# Altium project 243-5xx_Pi-CAN-PWM.PrjPcb
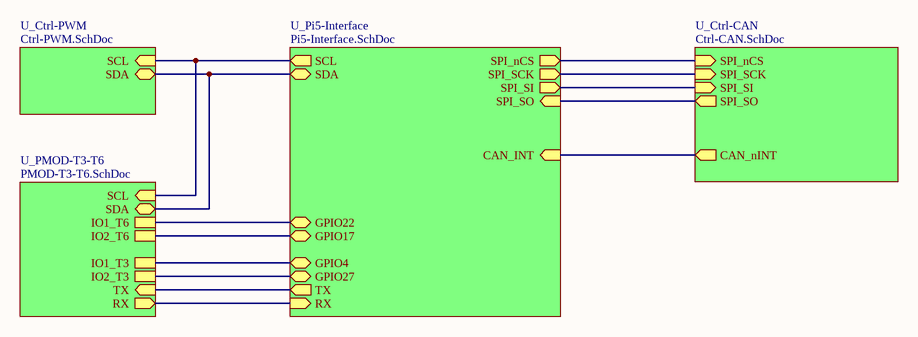
[diagram p0: 243-5xx_Pi-CAN-PWM.SchDoc]
Revision: Rev.B; NomDeProjet: 243-5xx Pi-CAN_PWM; NomDeLetudiant: Cégep Limoilou
5 sheets, 39 parts. Net scope: hierarchical (ports join the sheet entries above them; power ports are global).
Board file: 243-5xx_Pi-CAN-PWM.PcbDoc
Sheets:
  243-5xx_Pi-CAN-PWM.SchDoc
    U_Ctrl-CAN = Ctrl-CAN.SchDoc
    U_Ctrl-PWM = Ctrl-PWM.SchDoc
    U_Pi5-Interface = Pi5-Interface.SchDoc
    U_PMOD-T3-T6 = PMOD-T3-T6.SchDoc

## Sheet 243-5xx_Pi-CAN-PWM.SchDoc: CAN Controller + Transceiver and Ctrl PWM
size Letter; ApprovedBy: k.cotton; Author: Cégep Limoilou; Engineer: K.Cotton; Organization: Cegep Limoilou; Address1: 1300, 8e Avenue; Address2: Québec, QC; Address3: Canada; Address4: G1J 5L5; SheetNumber: 1; SheetTotal: 4

### Sub-sheets
U_Ctrl-CAN = Ctrl-CAN.SchDoc: SPI_nCS (in), SPI_SCK (in), SPI_SI (in), SPI_SO (out), CAN_nINT (out)
U_Ctrl-PWM = Ctrl-PWM.SchDoc: SCL (in), SDA (bidir)
U_Pi5-Interface = Pi5-Interface.SchDoc: SPI_SI (out), SPI_nCS (out), SPI_SCK (out), SPI_SO (in), SCL (out), SDA (bidir), RX (in), TX (out), CAN_INT (in), GPIO4 (bidir), GPIO27 (bidir), GPIO22 (bidir), GPIO17 (bidir)
U_PMOD-T3-T6 = PMOD-T3-T6.SchDoc: RX (out), TX (in), SCL (in), SDA (bidir), IO1_T3, IO2_T3, IO1_T6, IO2_T6

### Nets
CAN_INT: sheet U_Ctrl-CAN/CAN_nINT, sheet U_Pi5-Interface/CAN_INT
GPIO4: sheet U_Pi5-Interface/GPIO4, sheet U_PMOD-T3-T6/IO1_T3
GPIO17: sheet U_Pi5-Interface/GPIO17, sheet U_PMOD-T3-T6/IO2_T6
GPIO22: sheet U_Pi5-Interface/GPIO22, sheet U_PMOD-T3-T6/IO1_T6
GPIO27: sheet U_Pi5-Interface/GPIO27, sheet U_PMOD-T3-T6/IO2_T3
RX: sheet U_Pi5-Interface/RX, sheet U_PMOD-T3-T6/RX
SCL: sheet U_Ctrl-PWM/SCL, sheet U_Pi5-Interface/SCL, sheet U_PMOD-T3-T6/SCL
SDA: sheet U_Ctrl-PWM/SDA, sheet U_Pi5-Interface/SDA, sheet U_PMOD-T3-T6/SDA
SPI_nCS: sheet U_Ctrl-CAN/SPI_nCS, sheet U_Pi5-Interface/SPI_nCS
SPI_SCK: sheet U_Ctrl-CAN/SPI_SCK, sheet U_Pi5-Interface/SPI_SCK
SPI_SI: sheet U_Ctrl-CAN/SPI_SI, sheet U_Pi5-Interface/SPI_SI
SPI_SO: sheet U_Ctrl-CAN/SPI_SO, sheet U_Pi5-Interface/SPI_SO
TX: sheet U_Pi5-Interface/TX, sheet U_PMOD-T3-T6/TX

### Notes on the sheet
- Titre :
- Conception :
- Date :
- Approbation :
- Heure :
- Révision :
- Feuille
- de
- Fichier :

## Sheet Ctrl-CAN.SchDoc: SPI to CAN Controller/Transeiver
size Letter; ApprovedBy: k.cotton; Author: Cégep Limoilou; Engineer: K.Cotton; Organization: Cegep Limoilou; Address1: 1300, 8e Avenue; Address2: Québec, QC; Address3: Canada; Address4: G1J 5L5; SheetNumber: 3; SheetTotal: 5
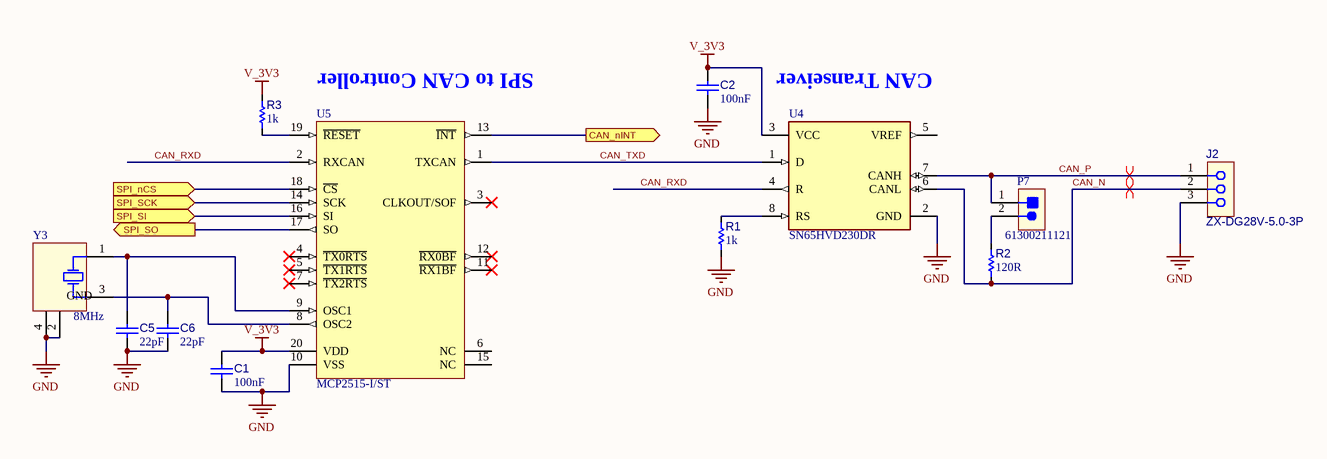
[diagram p1: Ctrl-CAN.SchDoc]

### Parts
C1  value 100nF  [C_1005[0402]]  (hidden comment: CAP CER 100nF 50V 0402)
C2  value 100nF  [C_1005[0402]]  (hidden comment: CAP CER 100nF 50V 0402)
C5  value 22pF  [C_1005[0402]]  (hidden comment: CAP CER 22pF 50V COG 0402)
C6  value 22pF  [C_1005[0402]]  (hidden comment: CAP CER 22pF 50V COG 0402)
J2  ZX-DG28V-5.0-3P  [CONN_TERM_BLOCK_3POS_5mm_Model1]
P7  61300211121  [CONN_HDR_2POS_100MILS_TH]
R1  value 1k  [R_1005[0402]]  (hidden comment: Res 1k 1% 0402)
R2  value 120R  [R_3216[1206]]  (hidden comment: Res 120R 1% 1206)
R3  value 1k  [R_1005[0402]]  (hidden comment: Res 1k 1% 0402)
U4  SN65HVD230DR  [FP-D0008A-IPC_A]
U5  MCP2515-I/ST  [TSSOP-ST20_N]
Y3  value 8MHz  [Y_32x25SMD4]  (hidden comment: XC32M4-8.000-F18LJDT)

### Ports
CAN_nINT (out, see 243-5xx_Pi-CAN-PWM[3B]), SPI_nCS (in, see 243-5xx_Pi-CAN-PWM[3B], Pi5-Interface[3C]), SPI_SCK (in, see 243-5xx_Pi-CAN-PWM[3B], Pi5-Interface[1C]), SPI_SI (in, see 243-5xx_Pi-CAN-PWM[3B], Pi5-Interface[1C]), SPI_SO (out, see 243-5xx_Pi-CAN-PWM[3B], Pi5-Interface[1C])

### Nets
GND: C1.1 C2.1 C5.1 C6.1 J2.3 R1.1 U4.2(GND) U5.10(VSS) Y3.2(GND) Y3.4(GND)
V_3V3: C1.2 C2.2 R3.2 U4.3(VCC) U5.20(VDD)
CAN_INT: U5.13(~{INT}) ; port CAN_nINT
CAN_N: J2.2 R2.1 U4.6(CANL)
CAN_P: J2.1 P7.1 U4.7(CANH)
CAN_RXD: U4.4(R) U5.2(RXCAN)
CAN_TXD: U4.1(D) U5.1(TXCAN)
SPI_nCS: U5.18(~{CS}) ; port SPI_nCS
SPI_SCK: U5.14(SCK) ; port SPI_SCK
SPI_SI: U5.16(SI) ; port SPI_SI
SPI_SO: U5.17(SO) ; port SPI_SO
NetC5_2: C5.2 U5.9(OSC1) Y3.1(XTAL)
NetC6_2: C6.2 U5.8(OSC2) Y3.3(XTAL)
NetP7_2: P7.2 R2.2
NetR1_2: R1.2 U4.8(RS)
NetR3_1: R3.1 U5.19(~{RESET})

Not connected (* = marked no-connect by the designer): U4 5(VREF); U5 3(CLKOUT/SOF)* 4(~{TX0RTS})* 5(~{TX1RTS})* 6(NC) 7(~{TX2RTS})* 11(~{RX1BF})* 12(~{RX0BF})* 15(NC)

### Layout directives
differential pair: CAN_N, CAN_P

### Notes on the sheet
- SPI to CAN Controller
- (near U4) CAN Transeiver
- Titre :
- Conception :
- Date :
- Approbation :
- Heure :
- Révision :
- Feuille
- de
- Fichier :

### Library data of the parts
C1 C2 = CAP001: Capacitor type 1; Manufacturer 1: Yageo; Manufacturer Part Number 1: CC0402KRX7R9BB104; LibRef: CAP001; Code CEGEP: KCOND01SM; Tolerance: 10%; Dielectric: X7R; Rated Voltage: 50V; Mounting Technology: SMT; Supplier 1: LCSC; Supplier Part Number 1: C131394
C5 C6 = CAP010: Capacitor type 1; Manufacturer 1: Yageo; Manufacturer Part Number 1: CC0402JRNPO9BN220; LibRef: CAP010; Tolerance: 5%; Dielectric: C0G; Rated Voltage: 50V; Mounting Technology: SMT; Supplier 1: LCSC; Supplier Part Number 1: C106203
J2 = CONN-5MM-3POS-TERM-BLOCK: CONN TERM BLOCK 3POS 5mm pitch; Manufacturer 1: Megastar; Code CEGEP: CONWECO0003 / KCONWECO0030; Localisation: / R13-E102; Supplier 1: LCSC; Supplier Part Number 1: ZX-DG28V-5.0-3P; Manufacturer Part Number 1: ZX-DG28V-5.0-3P; Mounting Technology: TH; Manufacturer 2: Weco - Phoenix Contact; Manufacturer Part Number 2: 950-DS/03 - 1890976
P7 = CONN-100MIL-HDR-01X02: CONN HEADER 2POS 100MIL; Manufacturer 1: Megastar; Manufacturer Part Number 1: ZX-PZ2.54-1-2PZZ; Mounting Technology: TH; Supplier 1: LCSC; Supplier Part Number 1: C7501260; Manufacturer 2: Würth Elektronik; Manufacturer Part Number 2: 61300211121
R1 R3 = RES006: Resistor type 1; Manufacturer 1: Yageo; Manufacturer Part Number 1: RC0402FR-071kL; LibRef: RES006; Code CEGEP: RES1KSM; Puissance: 1/16W; Max Working Voltage: 50V; Tolerance: 1%; Mounting Technology: SMT; Supplier 1: LCSC; Supplier Part Number 1: C106235
R2 = RES014: Resistor type 1; Manufacturer 1: Yageo; Manufacturer Part Number 1: RC1206FR-07120RL; LibRef: RES014; Code CEGEP: RESI0043SMT; Puissance: 1/4W; Max Working Voltage: 200V; Tolerance: 1%; Mounting Technology: SMT; Supplier 1: LCSC; Supplier Part Number 1: C114928; Supplier 2: Digikey; Supplier Part Number 2: P120ECT-ND
U4 = CMP-0315-00015-3: IC TRANSCEIVER HALF 1/1 8SOIC; Number of Transceivers: 1; Operating Supply Voltage: 3.3V; Number of I/Os: 2; Max Supply Current: 17mA; Max Supply Voltage: 3.6V; Min Supply Voltage: 3V; Data Rate: 1Mbps; Min Operating Temperature: -40°C; Packaging: Tape and Reel; Lead Free: Lead Free; Number of Transmit Buffers: 1; Max Operating Temperature: 85°C; Number of Receive Buffers: 1; Number of Pins: 8; Package Quantity: 1; Radiation Hardening: No; Case/Package: D; REACH SVHC: No SVHC; Weight: 0.002561oz; Termination: SMD/SMT; Contact Plating: Gold; Nominal Supply Current: 17mA; Number of Receivers: 1; Number of Drivers: 1
U5 = CMP-0186-00077-2: Stand-Alone CAN Controller With SPI Interface, 20-Pin TSSOP, Industrial Temperature; DatasheetVersion: revF, Oct-2010; ComponentLink1Description: Manufacturer URL; PackageDescription: 20-Lead Plastic Thin Shrink Small Outline (ST) - 4.4mm Body [TSSOP]; ComponentLink1URL: http://www.microchip.com/; RevisionNote: URLs added. DatasheetVersion updated.; PackageReference: TSSOP-ST20; Code_JEDEC: MO-153-AC; ComponentLink2Description: Datasheet; ComponentLink2URL: http://ww1.microchip.com/downloads/en/DeviceDoc/21801f.pdf; PackageVersion: revBB, Aug-2009; ComponentLink3URL: http://www.microchip.com/stellent/groups/techpub_sg/documents/packagingspec/en012702.pdf; ComponentLink3Description: Package Specification
Y3 = Y_XTAL25MHz: Crystal, 8MHz, 3.2 x 2.5 x 0.9 mm SMD; Manufacturer 1: HCI; Technology: SMT; Part Number 1: XC32M4-8.000-F18LJDT; Supplier 1: LCSC; Supplier Part Number 1: C2905353

## Sheet Ctrl-PWM.SchDoc: I2C to PWM Controller
size Letter; ApprovedBy: k.cotton; Author: Cégep Limoilou; Engineer: K.Cotton; Organization: Cegep Limoilou; Address1: 1300, 8e Avenue; Address2: Québec, QC; Address3: Canada; Address4: G1J 5L5; SheetNumber: 4; SheetTotal: 5
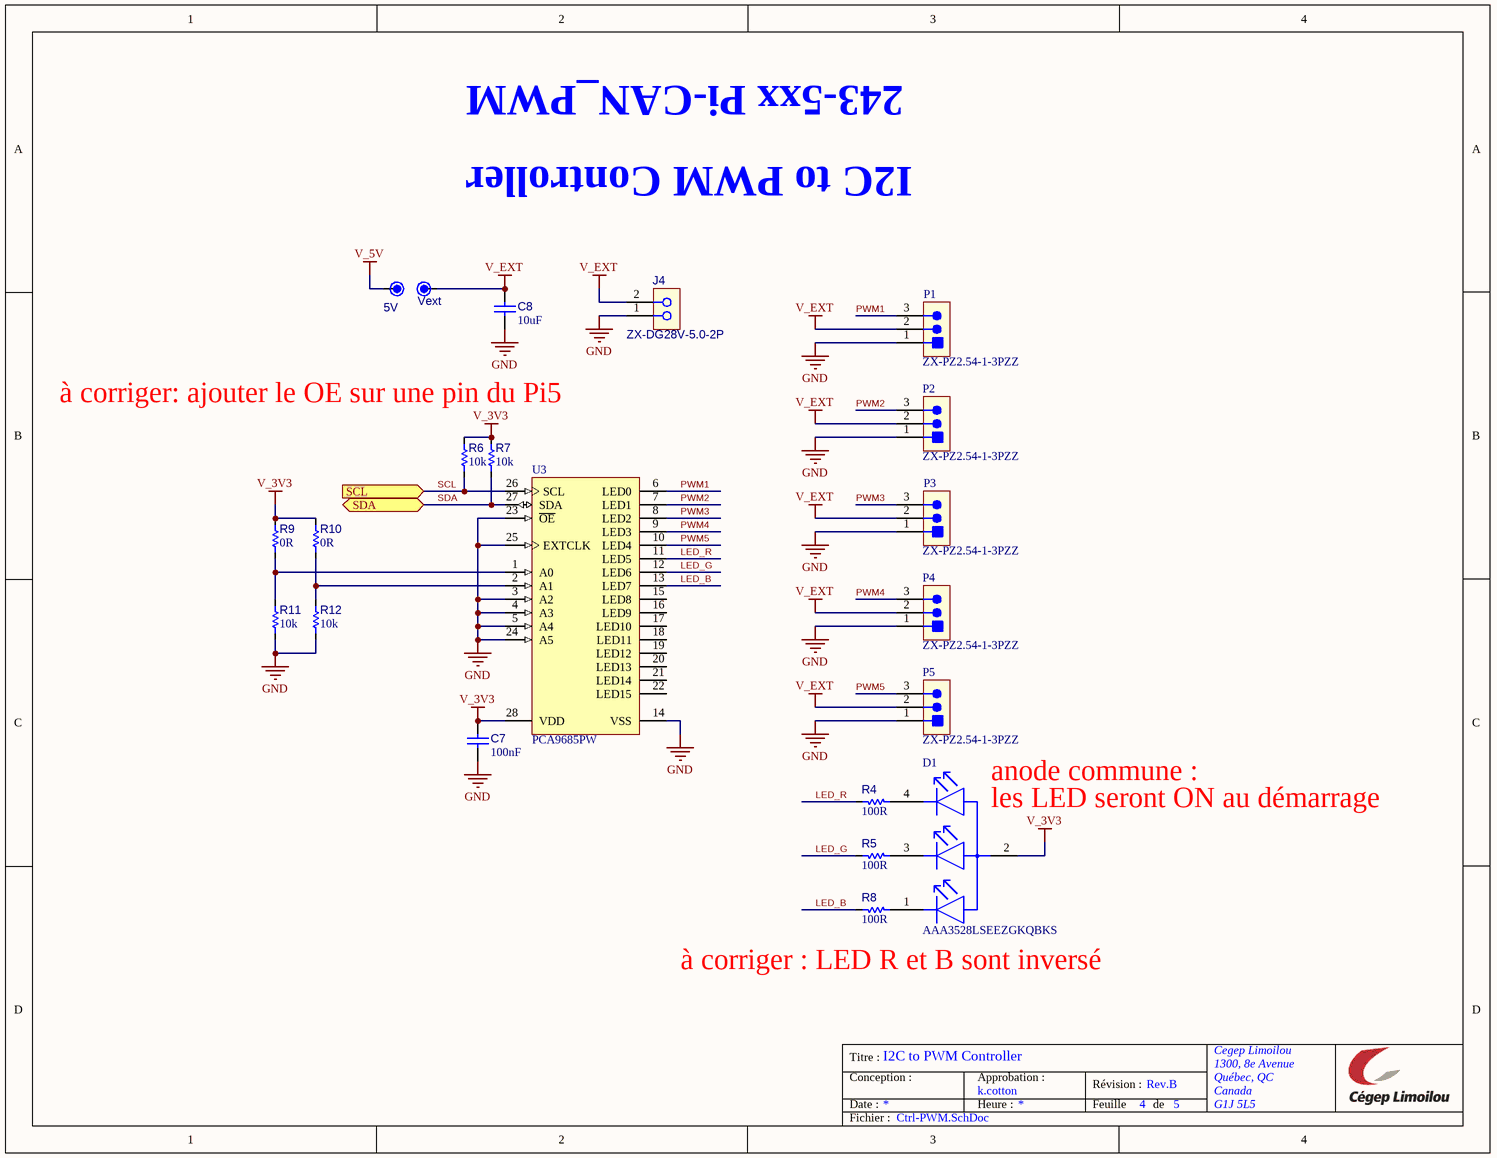
[diagram p2: Ctrl-PWM.SchDoc]

### Parts
5V  DNP  [TP_TH061]  (value not drawn)  (no BOM)
C7  value 100nF  [C_1005[0402]]  (hidden comment: CAP CER 100nF 50V 0402)
C8  value 10uF  [C_2012[0805]]  (hidden comment: CAP CER 10uF 10V X7R 0805)
D1  AAA3528LSEEZGKQBKS  [FP-AAA3528LSEEZGKQBKS-MFG]
J4  ZX-DG28V-5.0-2P  [CONN_TERM_BLOCK_2POS_5mm_Model1]
P1  ZX-PZ2.54-1-3PZZ  [CONN_HDR_3POS_100MILS_TH]
P2  ZX-PZ2.54-1-3PZZ  [CONN_HDR_3POS_100MILS_TH]
P3  ZX-PZ2.54-1-3PZZ  [CONN_HDR_3POS_100MILS_TH]
P4  ZX-PZ2.54-1-3PZZ  [CONN_HDR_3POS_100MILS_TH]
P5  ZX-PZ2.54-1-3PZZ  [CONN_HDR_3POS_100MILS_TH]
R4  value 100R  [R_1608[0603]]  (hidden comment: Res 100R 1% 0603)
R5  value 100R  [R_1608[0603]]  (hidden comment: Res 100R 1% 0603)
R6  value 10k  [R_1005[0402]]  (hidden comment: Res 10k 1% 0402)
R7  value 10k  [R_1005[0402]]  (hidden comment: Res 10k 1% 0402)
R8  value 100R  [R_1608[0603]]  (hidden comment: Res 100R 1% 0603)
R9  value 0R  [R_1005[0402]]  (hidden comment: DNP)  (no BOM)
R10  value 0R  [R_1005[0402]]  (hidden comment: DNP)  (no BOM)
R11  value 10k  [R_1005[0402]]  (hidden comment: Res 10k 1% 0402)
R12  value 10k  [R_1005[0402]]  (hidden comment: Res 10k 1% 0402)
U3  PCA9685PW  [TSSOP28_SOT361-1_V]
Vext  DNP  [TP_TH061]  (value not drawn)  (no BOM)

### Ports
SCL (in, see 243-5xx_Pi-CAN-PWM[2B], Pi5-Interface[2B], PMOD-T3-T6[2C]), SDA (bidir, see 243-5xx_Pi-CAN-PWM[2B], Pi5-Interface[2B], PMOD-T3-T6[2C])

### Nets
GND: C7.1 C8.1 J4.1 P1.1 P2.1 P3.1 P4.1 P5.1 R11.1 R12.1 U3.3(A2) U3.4(A3) U3.5(A4) U3.14(VSS) U3.23(~{OE}) U3.24(A5) U3.25(EXTCLK)
V_3V3: C7.2 D1.2(COMMON_ANODE) R6.2 R7.2 R9.2 R10.2 U3.28(VDD)
V_5V: 5V.1
V_EXT: C8.2 J4.2 P1.2 P2.2 P3.2 P4.2 P5.2 Vext.1
LED_B: R8.2 U3.13(LED7)
LED_G: R5.2 U3.12(LED6)
LED_R: R4.2 U3.11(LED5)
PWM1: P1.3 U3.6(LED0)
PWM2: P2.3 U3.7(LED1)
PWM3: P3.3 U3.8(LED2)
PWM4: P4.3 U3.9(LED3)
PWM5: P5.3 U3.10(LED4)
SCL: R6.1 U3.26(SCL) ; port SCL
SDA: R7.1 U3.27(SDA) ; port SDA
NetD1_1: D1.1(RED_C) R8.1
NetD1_3: D1.3(GREEN_C) R5.1
NetD1_4: D1.4(BLUE_C) R4.1
NetR9_1: R9.1 R11.2 U3.1(A0)
NetR10_1: R10.1 R12.2 U3.2(A1)

Not connected (* = marked no-connect by the designer): U3 15(LED8) 16(LED9) 17(LED10) 18(LED11) 19(LED12) 20(LED13) 21(LED14) 22(LED15)

### Notes on the sheet
- à corriger: ajouter le OE sur une pin du Pi5
- (near D1) anode commune :
- (near D1) les LED seront ON au démarrage
- à corriger : LED R et B sont inversé
- Titre :
- Conception :
- Date :
- Approbation :
- Heure :
- Révision :
- Feuille
- de
- Fichier :

### Library data of the parts
5V Vext = TP_TH0.61mm(AWG28): Pad TH 0.61mm diameter (AWG28); Value: DNP; Manufacturer Part Number 1: DNP; Supplier Part Number 1: N/A; Supplier 1: N/A
C7 = CAP001: as C1 on sheet Ctrl-CAN; Rated Voltage: 50V; Mounting Technology: SMT; Supplier 1: LCSC; Supplier Part Number 1: C131394
C8 = CAP004: Capacitor type 1; Manufacturer 1: muRata; Manufacturer Part Number 1: GRM21BR71A106KE51L; LibRef: CAP004; Code CEGEP: KCOND03SM; Tolerance: 10%; Rated Voltage: 10V; Dielectric: X7R; Mounting Technology: SMT; Supplier 1: LCSC; Supplier Part Number 1: C86038
D1 = CMP-44529-000043-1: LED RGB CLEAR 4SMD; Dominant Wavelength: 465nm; Test Current: 2mA; Color: Blue; Forward Voltage: 2.7V; Viewing Angle: 120°; Luminous Intensity: 30mcd; Lens Color: Colorless; Case/Package: PLCC; Packaging: Tape and Reel; Number of Pins: 4; Width: 2.8mm; Lens Transparency: Clear; Mount: Surface Mount; Height: 2.1mm; Length: 3.2mm
J4 = CONN-5MM-2POS-TERM-BLOCK: CONN TERM BLOCK 2POS 5mm pitch; Manufacturer 1: Megastar; Code CEGEP: CONWECO0002; Localisation: R13-B113; Supplier 1: LCSC; Supplier Part Number 1: C49022995; Manufacturer Part Number 1: ZX-DG28V-5.0-2P; Mounting Technology: TH; Manufacturer 2: Weidmüller - Phoenix Contact; Manufacturer Part Number 2: 1760510000 - 1890963
P1-P5 = CONN-100MIL-HDR-01X03: CONN HEADER 3pins single row, 100 mils TH; Manufacturer 1: Megastar; Manufacturer Part Number 1: ZX-PZ2.54-1-3PZZ; Mounting Technology: TH; Supplier 1: LCSC; Supplier Part Number 1: C7501261
R4 R5 R8 = RES029: Resistor type 1; Manufacturer 1: Yageo; Manufacturer Part Number 1: RC0603FR-07100RL; LibRef: RES029; Puissance: 1/10W; Max Working Voltage: 75V; Tolerance: 1%; Mounting Technology: SMT; Supplier 1: LCSC; Supplier Part Number 1: C105588
R6 R7 R11 R12 = RES003: Resistor type 1; Manufacturer 1: Yageo; Manufacturer Part Number 1: RC0402FR-0710KL; LibRef: RES003; Puissance: 1/16W; Max Working Voltage: 50V; Tolerance: 1%; Mounting Technology: SMT; Supplier 1: LCSC; Supplier Part Number 1: C60490
R9 R10 = RES005: Resistor type 1; Manufacturer 1: Yageo; Manufacturer Part Number 1: RC0402JR-070RL; LibRef: RES005; Code CEGEP: RES0SM; Max Working Voltage: 50V; Mounting Technology: SMT; Supplier 1: LCSC; Supplier Part Number 1: C60485
U3 = U_PCA9685PW: 16-Channel, 12-Bit PWM I2C-Bus LED Controller, 28-Pin TSSOP (SOT361-1); Manufacturer 1: NXP; Manufacturer Part Number 1: PCA9685PW,112; Mount: SMT; Supplier 1: Digi-Key; Supplier Part Number 1: 568-8366-5-ND

## Sheet Pi5-Interface.SchDoc: Raspberry Pi - Interface
size Letter; ApprovedBy: k.cotton; Author: Cégep Limoilou; Engineer: K.Cotton; Organization: Cegep Limoilou; Address1: 1300, 8e Avenue; Address2: Québec, QC; Address3: Canada; Address4: G1J 5L5; SheetNumber: 2; SheetTotal: 5
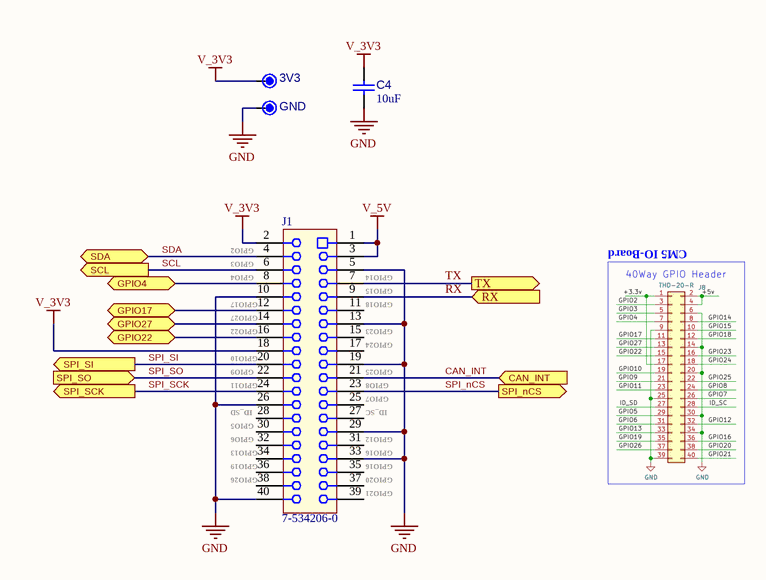
[diagram p3: Pi5-Interface.SchDoc]

### Parts
3V3  DNP  [TP_TH061]  (value not drawn)  (no BOM)
C4  value 10uF  [C_2012[0805]]  (hidden comment: CAP CER 10uF 10V X7R 0805)
GND  DNP  [TP_TH061]  (value not drawn)  (no BOM)
J1  7-534206-0  [CONN_Receptacle_2x20pos_100mil]

### Ports
CAN_INT (in, see 243-5xx_Pi-CAN-PWM[3B]), GPIO4 (bidir, see 243-5xx_Pi-CAN-PWM[2C]), GPIO17 (bidir, see 243-5xx_Pi-CAN-PWM[2C]), GPIO22 (bidir, see 243-5xx_Pi-CAN-PWM[2C]), GPIO27 (bidir, see 243-5xx_Pi-CAN-PWM[2C]), RX (in, see 243-5xx_Pi-CAN-PWM[2C], PMOD-T3-T6[2C]), SCL (out, see 243-5xx_Pi-CAN-PWM[2B], Ctrl-PWM[1B], PMOD-T3-T6[2C]), SDA (bidir, see 243-5xx_Pi-CAN-PWM[2B], Ctrl-PWM[1B], PMOD-T3-T6[2C]), SPI_nCS (out, see 243-5xx_Pi-CAN-PWM[3B], Ctrl-CAN[1C]), SPI_SCK (out, see 243-5xx_Pi-CAN-PWM[3B], Ctrl-CAN[1C]), SPI_SI (out, see 243-5xx_Pi-CAN-PWM[3B], Ctrl-CAN[1C]), SPI_SO (in, see 243-5xx_Pi-CAN-PWM[3B], Ctrl-CAN[1C]), TX (out, see 243-5xx_Pi-CAN-PWM[2C], PMOD-T3-T6[2C])

### Nets
GND: C4.1 GND.1 J1.5 J1.10 J1.13 J1.19 J1.26 J1.29 J1.33 J1.40
V_3V3: 3V3.1 C4.2 J1.2 J1.18
V_5V: J1.1 J1.3
CAN_INT: J1.21 ; port CAN_INT
GPIO4: J1.8 ; port GPIO4
GPIO17: J1.12 ; port GPIO17
GPIO22: J1.16 ; port GPIO22
GPIO27: J1.14 ; port GPIO27
RX: J1.9 ; port RX
SCL: J1.6 ; port SCL
SDA: J1.4 ; port SDA
SPI_nCS: J1.23 ; port SPI_nCS
SPI_SCK: J1.24 ; port SPI_SCK
SPI_SI: J1.20 ; port SPI_SI
SPI_SO: J1.22 ; port SPI_SO
TX: J1.7 ; port TX

Not connected (* = marked no-connect by the designer): J1 11 15 17 25 27 28 30 31 32 34 35 36 37 38 39

### Notes on the sheet
- (near J1) GPIO2
- (near J1) GPIO3
- (near J1) GPIO4
- (near J1) GPIO14
- (near J1) GPIO15
- CM5 IO-Board
- (near J1) GPIO10
- (near J1) GPIO17
- (near J1) GPIO27
- (near J1) GPIO22
- (near J1) GPIO23
- (near J1) GPIO24
- (near J1) GPIO18
- (near J1) GPIO9
- (near J1) GPIO11
- (near J1) GPIO5
- (near J1) ID_SD
- (near J1) GPIO7
- (near J1) GPIO8
- (near J1) GPIO25
- (near J1) ID_SC
- (near J1) GPIO13
- (near J1) GPIO26
- (near J1) GPIO6
- (near J1) GPIO19
- (near J1) GPIO12
- (near J1) GPIO16
- (near J1) GPIO20
- (near J1) GPIO21
- Titre :
- Conception :
- Date :
- Approbation :
- Heure :
- Révision :
- Feuille
- de
- Fichier :

### Library data of the parts
3V3 GND = TP_TH0.61mm(AWG28): Pad TH 0.61mm diameter (AWG28); Value: DNP; Manufacturer Part Number 1: DNP; Supplier Part Number 1: N/A; Supplier 1: N/A
C4 = CAP004: as C8 on sheet Ctrl-PWM; Rated Voltage: 10V; Dielectric: X7R; Mounting Technology: SMT; Supplier 1: LCSC; Supplier Part Number 1: C86038
J1 = CONN-100MIL-SKT-02X20: CONN SOCKET 2x20POS 2.54mm; Manufacturer 1: Megastar; Manufacturer Part Number 1: ZX-PM2.54-2-20PY; Code CEGEP: CON40; Mounting Technology: TH; Supplier 1: LCSC; Supplier Part Number 1: C7499354; Manufacturer 2: Sullins; Manufacturer 3: TE Connectivity; Manufacturer Part Number 2: PPTC202LFBN-RC; Manufacturer Part Number 3: 7-534206-0; Supplier 2: Digikey; Supplier 3: S6104-ND

## Sheet PMOD-T3-T6.SchDoc: Expansipon PMOD type 3 et 6
size Letter; ApprovedBy: k.cotton; Author: Cégep Limoilou; Engineer: K.Cotton; Organization: Cegep Limoilou; Address1: 1300, 8e Avenue; Address2: Québec, QC; Address3: Canada; Address4: G1J 5L5; SheetNumber: 5; SheetTotal: 5
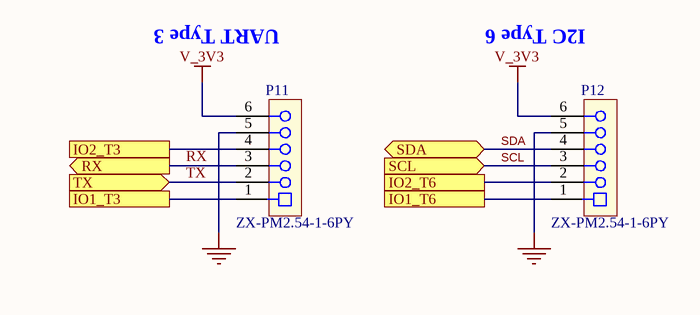
[diagram p4: PMOD-T3-T6.SchDoc]

### Parts
P11  ZX-PM2.54-1-6PY  [CONN_SKT_01X06_100MIL]
P12  ZX-PM2.54-1-6PY  [CONN_SKT_01X06_100MIL]

### Ports
IO1_T3 (see 243-5xx_Pi-CAN-PWM[2C]), IO1_T6 (see 243-5xx_Pi-CAN-PWM[2C]), IO2_T3 (see 243-5xx_Pi-CAN-PWM[2C]), IO2_T6 (see 243-5xx_Pi-CAN-PWM[2C]), RX (out, see 243-5xx_Pi-CAN-PWM[2C], Pi5-Interface[2B]), SCL (in, see 243-5xx_Pi-CAN-PWM[2C], Ctrl-PWM[1B], Pi5-Interface[1B]), SDA (bidir, see 243-5xx_Pi-CAN-PWM[2C], Ctrl-PWM[1B], Pi5-Interface[1B]), TX (in, see 243-5xx_Pi-CAN-PWM[2C], Pi5-Interface[2B])

### Nets
GND: P11.5 P12.5
V_3V3: P11.6 P12.6
GPIO4: P11.1 ; port IO1_T3
GPIO17: P12.2 ; port IO2_T6
GPIO22: P12.1 ; port IO1_T6
GPIO27: P11.4 ; port IO2_T3
RX: P11.3 ; port RX
SCL: P12.3 ; port SCL
SDA: P12.4 ; port SDA
TX: P11.2 ; port TX

### Notes on the sheet
- UART Type 3
- I2C Type 6
- Titre :
- Conception :
- Date :
- Approbation :
- Heure :
- Révision :
- Feuille
- de
- Fichier :

### Library data of the parts
P11 P12 = CONN-100MIL-SKT-01X06: CONN SOCKET 6pos 100mils; Manufacturer 1: Megastar; Mounting Technology: TH; Manufacturer Part Number 1: ZX-PM2.54-1-6PY; Supplier 1: LCSC; Supplier Part Number 1: C7499326

## Nets that join several sheets
GND: Ctrl-CAN (10 pins), Ctrl-PWM (17 pins), Pi5-Interface (10 pins), PMOD-T3-T6 (P11.5 P12.5)
V_3V3: Ctrl-CAN (5 pins), Ctrl-PWM (7 pins), Pi5-Interface (3V3.1 C4.2 J1.2 J1.18), PMOD-T3-T6 (P11.6 P12.6)
V_5V: Ctrl-PWM (5V.1), Pi5-Interface (J1.1 J1.3)
CAN_INT: Ctrl-CAN (U5.13), Pi5-Interface (J1.21)
GPIO4: Pi5-Interface (J1.8), PMOD-T3-T6 (P11.1)
GPIO17: Pi5-Interface (J1.12), PMOD-T3-T6 (P12.2)
GPIO22: Pi5-Interface (J1.16), PMOD-T3-T6 (P12.1)
GPIO27: Pi5-Interface (J1.14), PMOD-T3-T6 (P11.4)
RX: Pi5-Interface (J1.9), PMOD-T3-T6 (P11.3)
SCL: Ctrl-PWM (R6.1 U3.26), Pi5-Interface (J1.6), PMOD-T3-T6 (P12.3)
SDA: Ctrl-PWM (R7.1 U3.27), Pi5-Interface (J1.4), PMOD-T3-T6 (P12.4)
SPI_nCS: Ctrl-CAN (U5.18), Pi5-Interface (J1.23)
SPI_SCK: Ctrl-CAN (U5.14), Pi5-Interface (J1.24)
SPI_SI: Ctrl-CAN (U5.16), Pi5-Interface (J1.20)
SPI_SO: Ctrl-CAN (U5.17), Pi5-Interface (J1.22)
TX: Pi5-Interface (J1.7), PMOD-T3-T6 (P11.2)

## Assembly variants
CAN only: not fitted 5V C7 C8 D1 J4 P1 P2 P3 P4 P5 P11 P12 R4 R5 R6 R7 R8 R9 R10 R11 R12 U3 Vext